# EAGLE schematic espresso-switch-eagle (EAGLE 9.5.0)
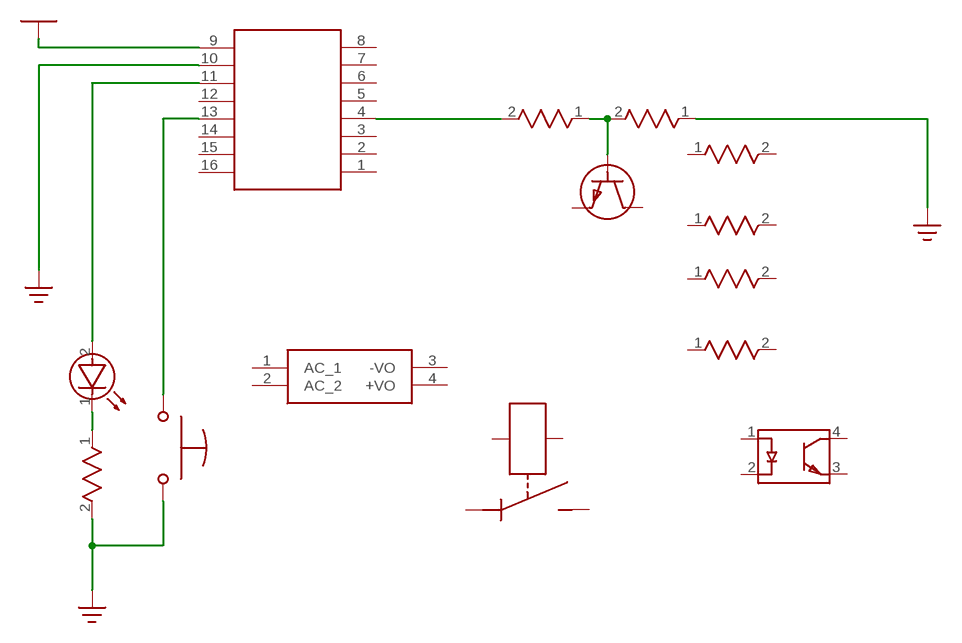
[diagram p0: schematic, sheet 1]

## Parts
D1  LED  [LED100]
K1  RELAY_STATIC  (no package)
PS1  HLK-5M05  [HLK5M05]
Q1  NPN  (no package)
R1  RES  [RES-7.62/4X1.5]
R2  RES  [RES-7.62/4X1.5]
R3  RES  [RES-7.62/4X1.5]
R4  RES  [RES-7.62/4X1.5]
R5  RES  [RES-7.62/4X1.5]
R6  RES  [RES-7.62/4X1.5]
R7  200  RES  [RES-7.62/4X1.5]
S1  PUSHBUTTON_NO  (no package)
U1  D1_MINI  [D1-MINI]
VO1  LTV-817M  [DIP-4/400MIL]

## Nets
NET_0: U1.9(5V) ; supply symbol labelled +5V
NET_1: R2.1(A) R7.2(B) S1.C2 U1.10(GND) ; supply symbol labelled GND
NET_2: D1.2(A) U1.11(D4)
NET_3: D1.1(K) R7.1(A)
NET_4: S1.C1 U1.13(D2)
NET_5: Q1.B R1.1(A) R2.2(B)
NET_6: R1.2(B) U1.4(D5)
Unconnected: K1.1 K1.2 K1.3 K1.4 PS1.1(AC_1) PS1.2(AC_2) PS1.3(-VO) PS1.4(+VO) Q1.C Q1.E R3.1(A) R3.2(B) R4.1(A) R4.2(B) R5.1(A) R5.2(B) R6.1(A) R6.2(B) U1.1(RST) U1.2(A0) U1.3(D0) U1.5(D6) U1.6(D7) U1.7(D8) U1.8(3V3) U1.12(D3) U1.14(D1) U1.15(RX) U1.16(TX) VO1.1(ANODE) VO1.2(CATHODE) VO1.3(EMITTER) VO1.4(COLLECTOR)

## Library data of the parts
D1 = common:LED
K1 = common:RELAY_STATIC; ATTR_1: Semiconductor Make Contact; DESCRIPTION: Static Relay
PS1 = common:HLK-5M05; DESCRIPTION: 5W ultra-compact power module HLK-5M05; HEIGHT: 18mm; MANUFACTURER_NAME: Hi-Link; MANUFACTURER_PART_NUMBER: HLK-5M05
Q1 = common:NPN; DESCRIPTION: Bipolar NPN
R1-R6 = common:RES; VALUE: 200
R7 = common:RES
S1 = common:PUSHBUTTON_NO; ATTR_1: Normally Open; DESCRIPTION: Pushbutton
U1 = common:D1_MINI; DESCRIPTION: wifi board based on ESP-8266EX.; HEIGHT: mm; MANUFACTURER_NAME: Wemos; MANUFACTURER_PART_NUMBER: D1 Mini
VO1 = common:LTV-817M; DATASHEET: http://datasheets.diptrace.com/optoisolators/LTV-817_827_847.pdf; MANUFACTURER: Lite-On